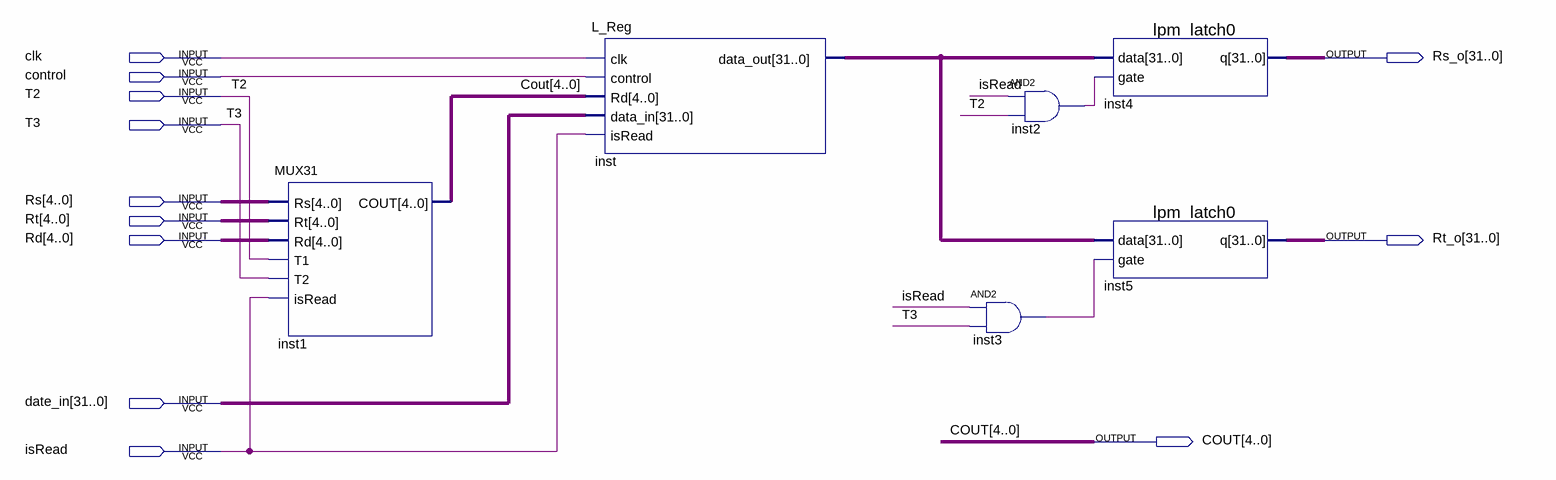
[diagram p0: schematic sheet]
// Quartus schematic Reg_s.bdf as structural Verilog: 6 symbols, 12 pins
module Reg_s (
  input  clk,
  input  control,
  input  T2,
  input  T3,
  input  [4:0] Rs,
  input  [4:0] Rt,
  input  [4:0] Rd,
  input  [31:0] date_in,
  input  isRead,
  output [31:0] Rs_o,
  output [31:0] Rt_o,
  output [4:0] COUT
);

  wire inst2_out, inst3_out;
  wire [31:0] inst_data_out;

  MUX31 inst1 (.Rs(Rs), .Rt(Rt), .Rd(Rd), .T1(T2), .T2(T3), .isRead(isRead), .COUT(COUT));
  L_Reg inst (.clk(clk), .control(control), .Rd(COUT), .data_in(date_in), .isRead(isRead), .data_out(inst_data_out));
  and inst3 (inst3_out, isRead, T3);
  and inst2 (inst2_out, isRead, T2);
  lpm_latch0 inst4 (.data(inst_data_out), .gate(inst2_out), .q(Rs_o));
  lpm_latch0 inst5 (.data(inst_data_out), .gate(inst3_out), .q(Rt_o));
endmodule
